# Altium schematic sheet iPhone11ProMaxWXCD.SchDoc
size A
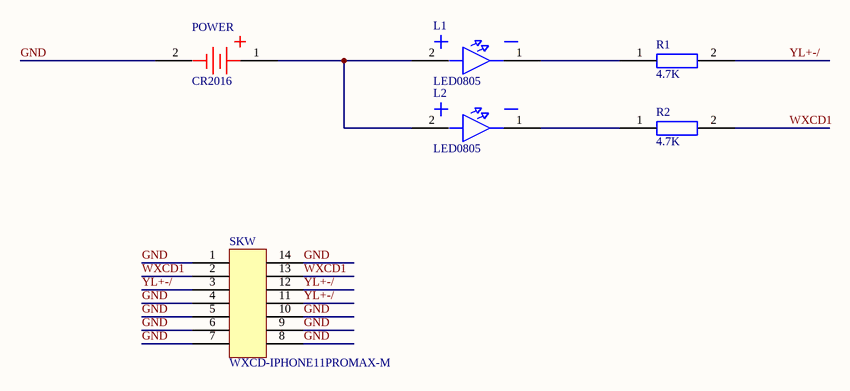
[diagram p0: iPhone11ProMaxWXCD.SchDoc]

## Parts
L1  LED0805  [LED0805]
L2  LED0805  [LED0805]
POWER  CR2016  [CR2016]
R1  4.7K  [R0805]
R2  4.7K  [R0805]
SKW  WXCD-IPHONE11PROMAX-M  [IPHONE11PROMAX-WXCD-M]

## Nets
GND: POWER.2 SKW.1 SKW.4 SKW.5 SKW.6 SKW.7 SKW.8 SKW.9 SKW.10 SKW.14
WXCD1: R2.2 SKW.2 SKW.13
YL+-/: R1.2 SKW.3 SKW.11 SKW.12
NetL1_1: L1.1 R1.1
NetL1_2: L1.2 L2.2 POWER.1
NetL2_1: L2.1 R2.1

## Library data of the parts
R1 R2 = R0805